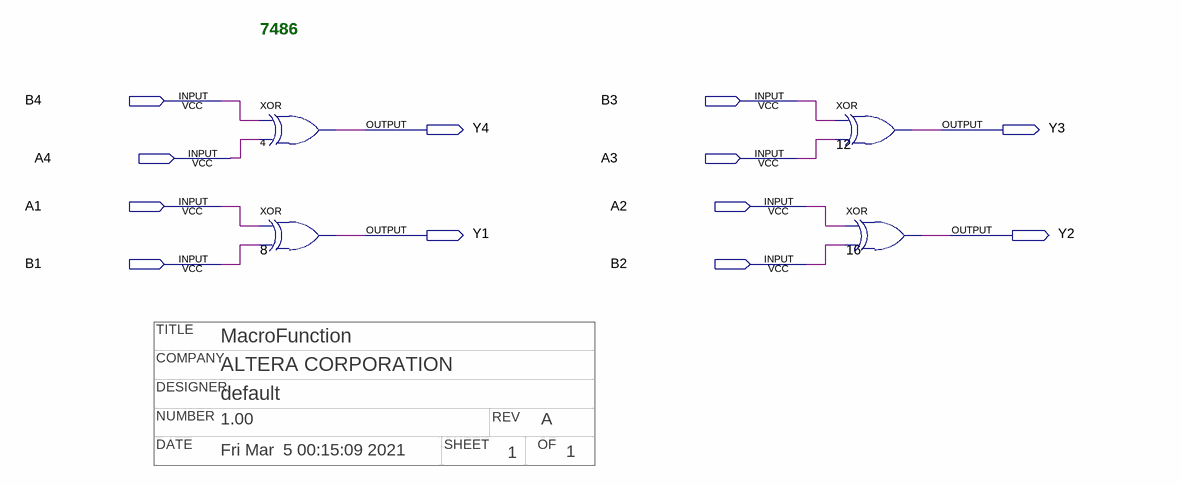
[diagram p0: schematic sheet]
// Quartus schematic 74LS86.bdf as structural Verilog: 4 symbols, 12 pins
// Title block: TITLE: MacroFunction; COMPANY: ALTERA CORPORATION; DESIGNER: default; NUMBER: 1.00; REV: A; DATE: Fri Mar  5 00:15:09 2021; SHEET: 1; OF: 1
module \74LS86  (
  input  B4,
  input  B3,
  input  A4,
  input  A3,
  input  A1,
  input  A2,
  input  B1,
  input  B2,
  output Y4,
  output Y3,
  output Y1,
  output Y2
);

  xor u_4 (Y4, B4, A4);
  xor u_8 (Y1, A1, B1);
  xor u_12 (Y3, B3, A3);
  xor u_16 (Y2, A2, B2);

  // Notes on the sheet:
  //   7486
endmodule
